# EAGLE schematic Y-babies ATtiny84 (EAGLE 6.5.0)
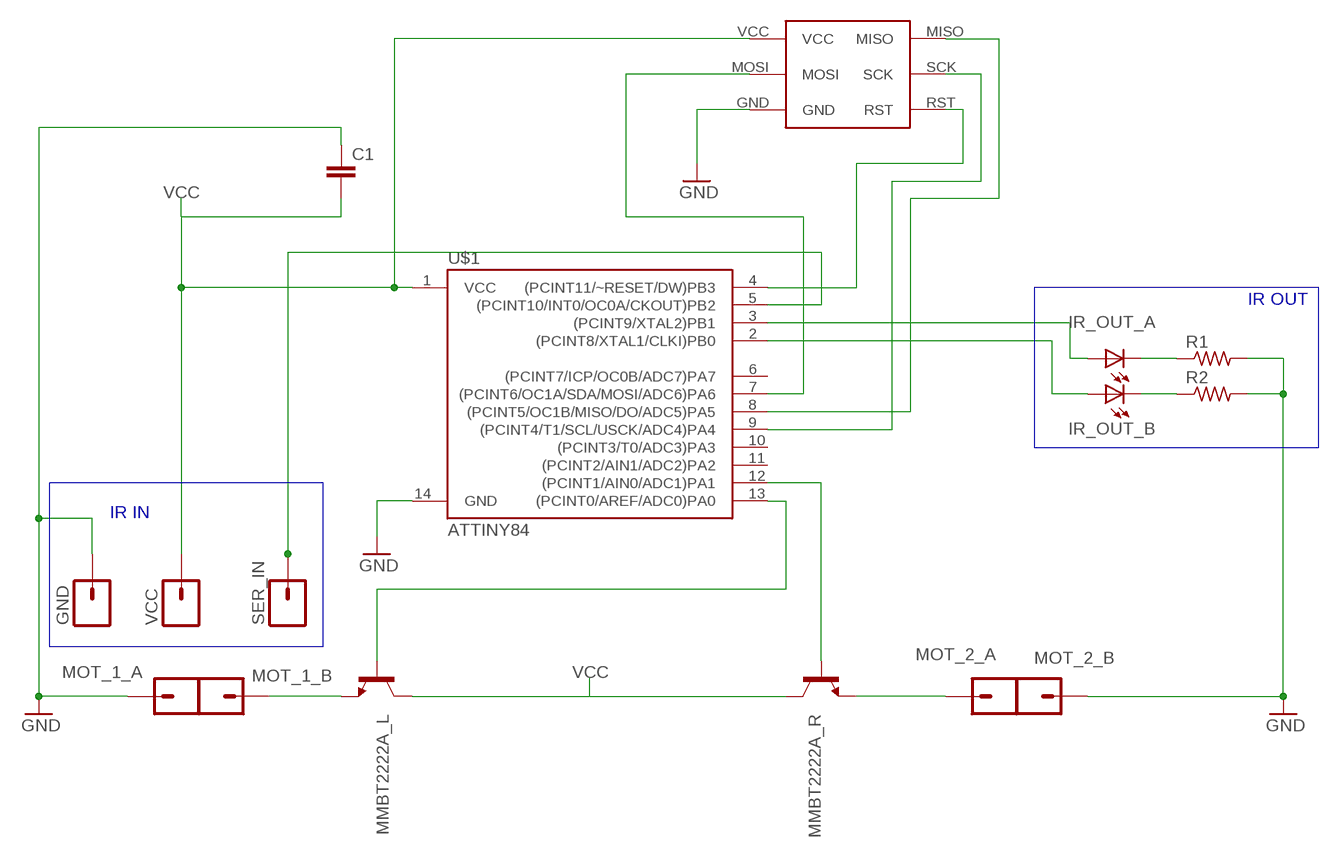
[diagram p0: schematic, sheet 1]

## Parts
C1  CAPSMD  [GRM43D]
GND  M01PTH  [1X01]
IR_OUT_A  LED3MM  [LED3MM]
IR_OUT_B  LED3MM  [LED3MM]
MMBT2222A_L  TRANSISTOR_NPNSOT23  [SOT23]
MMBT2222A_R  TRANSISTOR_NPNSOT23  [SOT23]
MOT_1_A  M01SMD-4.5X1.5  [PAD-1.5X4.5]
MOT_1_B  M01SMD-4.5X1.5  [PAD-1.5X4.5]
MOT_2_A  M01SMD-4.5X1.5  [PAD-1.5X4.5]
MOT_2_B  M01SMD-4.5X1.5  [PAD-1.5X4.5]
R1  R-US_R0805W  [R0805W]
R2  R-US_R0805W  [R0805W]
SER_IN  M01PTH  [1X01]
U$1  ATTINY84  [SO14]
U$2  POGO_PIN_SPI_PAD  [POGO_PIN_SPI_PAD]
VCC  M01PTH  [1X01]

## Nets
GND: C1.A GND.1 MOT_1_A.P$1 MOT_2_B.P$1 R1.2 R2.2 U$1.14(GND) U$2.GND
N$3: IR_OUT_B.A U$1.2((PCINT8/XTAL1/CLKI)PB0)
N$4: IR_OUT_B.K(C) R2.1
N$5: U$1.4((PCINT11/~RESET/DW)PB3) U$2.RST
N$6: IR_OUT_A.A U$1.3((PCINT9/XTAL2)PB1)
N$7: IR_OUT_A.K(C) R1.1
N$8: SER_IN.1 U$1.5((PCINT10/INT0/OC0A/CKOUT)PB2)
N$9: MMBT2222A_L.2(E) MOT_1_B.P$1
N$10: MMBT2222A_R.2(E) MOT_2_A.P$1
N$11: U$1.9((PCINT4/T1/SCL/USCK/ADC4)PA4) U$2.SCK
N$12: U$1.8((PCINT5/OC1B/MISO/DO/ADC5)PA5) U$2.MISO
N$13: U$1.7((PCINT6/OC1A/SDA/MOSI/ADC6)PA6) U$2.MOSI
N$14: MMBT2222A_L.1(B) U$1.13((PCINT0/AREF/ADC0)PA0)
N$15: MMBT2222A_R.1(B) U$1.12((PCINT1/AIN0/ADC1)PA1)
VCC: C1.C MMBT2222A_L.3(C) MMBT2222A_R.3(C) U$1.1(VCC) U$2.VCC VCC.1
Unconnected: U$1.6((PCINT7/ICP/OC0B/ADC7)PA7) U$1.10((PCINT3/T0/ADC3)PA3) U$1.11((PCINT2/AIN1/ADC2)PA2)

## Buses
B$1
B$2

## Notes on the sheet
- IR OUT
- IR IN

## Library data of the parts
C1 = SparkFun:CAP: Capacitor Standard 0603 ceramic capacitor, and 0.1" leaded capacitor.
GND MOT_1_A MOT_1_B MOT_2_A MOT_2_B SER_IN VCC = SparkFun:M01: Header 1 Standard 1-pin 0.1" header. Use with straight break away headers (SKU : PRT-00116), right angle break away headers (PRT-00553), swiss pins (PRT-00743), machine pins (PRT-00117), and female headers (PRT-00115).
IR_OUT_A IR_OUT_B = led:LED: LED OSRAM: - CHIPLED LG R971, LG N971, LY N971, LG Q971, LY Q971, LO R971, LY R971 LH N974, LH R974 LS Q976, LO Q976, LY Q976 LO Q996 - Hyper CHIPLED LW Q18S LB Q993, LB Q99A, LB R99A - SideLED LS A670, LO A670, LY A670, LG A670, LP A670 LB A673, LV A673, LT A673, LW A673 LH A674 LY A675 LS A676, LA A676, LO A676, LY A676, LW A676 LS A679, LY A679, LG A679 - Hyper Micro SIDELED® LS Y876, LA Y876, LO Y876, LY Y876 LT Y87S - SmartLED LW L88C, LW L88S LB L89C, LB L89S, LG L890 LS L89K, LO L89K, LY L89K LS L896, LA L896, LO L896, LY L896 - TOPLED LS T670, LO T670, LY T670, LG T670, LP T670 LSG T670, LSP T670, LSY T670, LOP T670, LYG T670 LG T671, LOG T671, LSG T671 LB T673, LV T673, LT T673, LW T673 LH T674 LS T676, LA T676, LO T676, LY T676, LB T676, LH T676, LSB T676, LW T676 LB T67C, LV T67C, LT T67C, LS T67K, LO T67K, LY T67K, LW E67C LS E67B, LA E67B, LO E67B, LY E67B, LB E67C, LV E67C, LT E67C LW T67C LS T679, LY T679, LG T679 LS T770, LO T770, LY T770, LG T770, LP T770 LB T773, LV T773, LT T773, LW T773 LH T774 LS E675, LA E675, LY E675, LS T675 LS T776, LA T776, LO T776, LY T776, LB T776 LHGB T686 LT T68C, LB T68C - Hyper Mini TOPLED® LB M676 - Mini TOPLED Santana® LG M470 LS M47K, LO M47K, LY M47K Source: http://www.osram.convergy.de LUXEON: - LUMILED® LXK2-PW12-R00, LXK2-PW12-S00, LXK2-PW14-U00, LXK2-PW14-V00 LXK2-PM12-R00, LXK2-PM12-S00, LXK2-PM14-U00 LXK2-PE12-Q00, LXK2-PE12-R00, LXK2-PE12-S00, LXK2-PE14-T00, LXK2-PE14-U00 LXK2-PB12-K00, LXK2-PB12-L00, LXK2-PB12-M00, LXK2-PB14-N00, LXK2-PB14-P00, LXK2-PB14-Q00 LXK2-PR12-L00, LXK2-PR12-M00, LXK2-PR14-Q00, LXK2-PR14-R00 LXK2-PD12-Q00, LXK2-PD12-R00, LXK2-PD12-S00 LXK2-PH12-R00, LXK2-PH12-S00 LXK2-PL12-P00, LXK2-PL12-Q00, LXK2-PL12-R00 Source: www.luxeon.com KINGBRIGHT: KA-3528ASYC Source: www.kingbright.com
MMBT2222A_L MMBT2222A_R = SparkFun:TRANSISTOR_NPN: Transistor NPN BJT configuration in SOT23 package. MMBT2222 is the common NPN we use. Double check BCE configuration again layout.
R1 R2 = resistor:R-US_: RESISTOR, American symbol
U$1 = SparkFun-DigitalIC:ATTINY84: Atmel 14-pin 2/4/8kB flash uC
U$2 = Random parts:POGO_PIN_SPI_PAD